# EasyEDA Pro project ProPrj_ETHlink8xADC_2025-03-31.epro, schematic ETHlink8xADC_Schematic, sheets 11 to 13 of 13

## Sheets
11 Preamp CH_7: Create Date: 2024-06-27; Page Name: Preamp CH_7; Schematic Name: Schematic1; Company: EMinc.; Part Number: 001; Reviewed: Eugenio Mancini; Version: V0.1
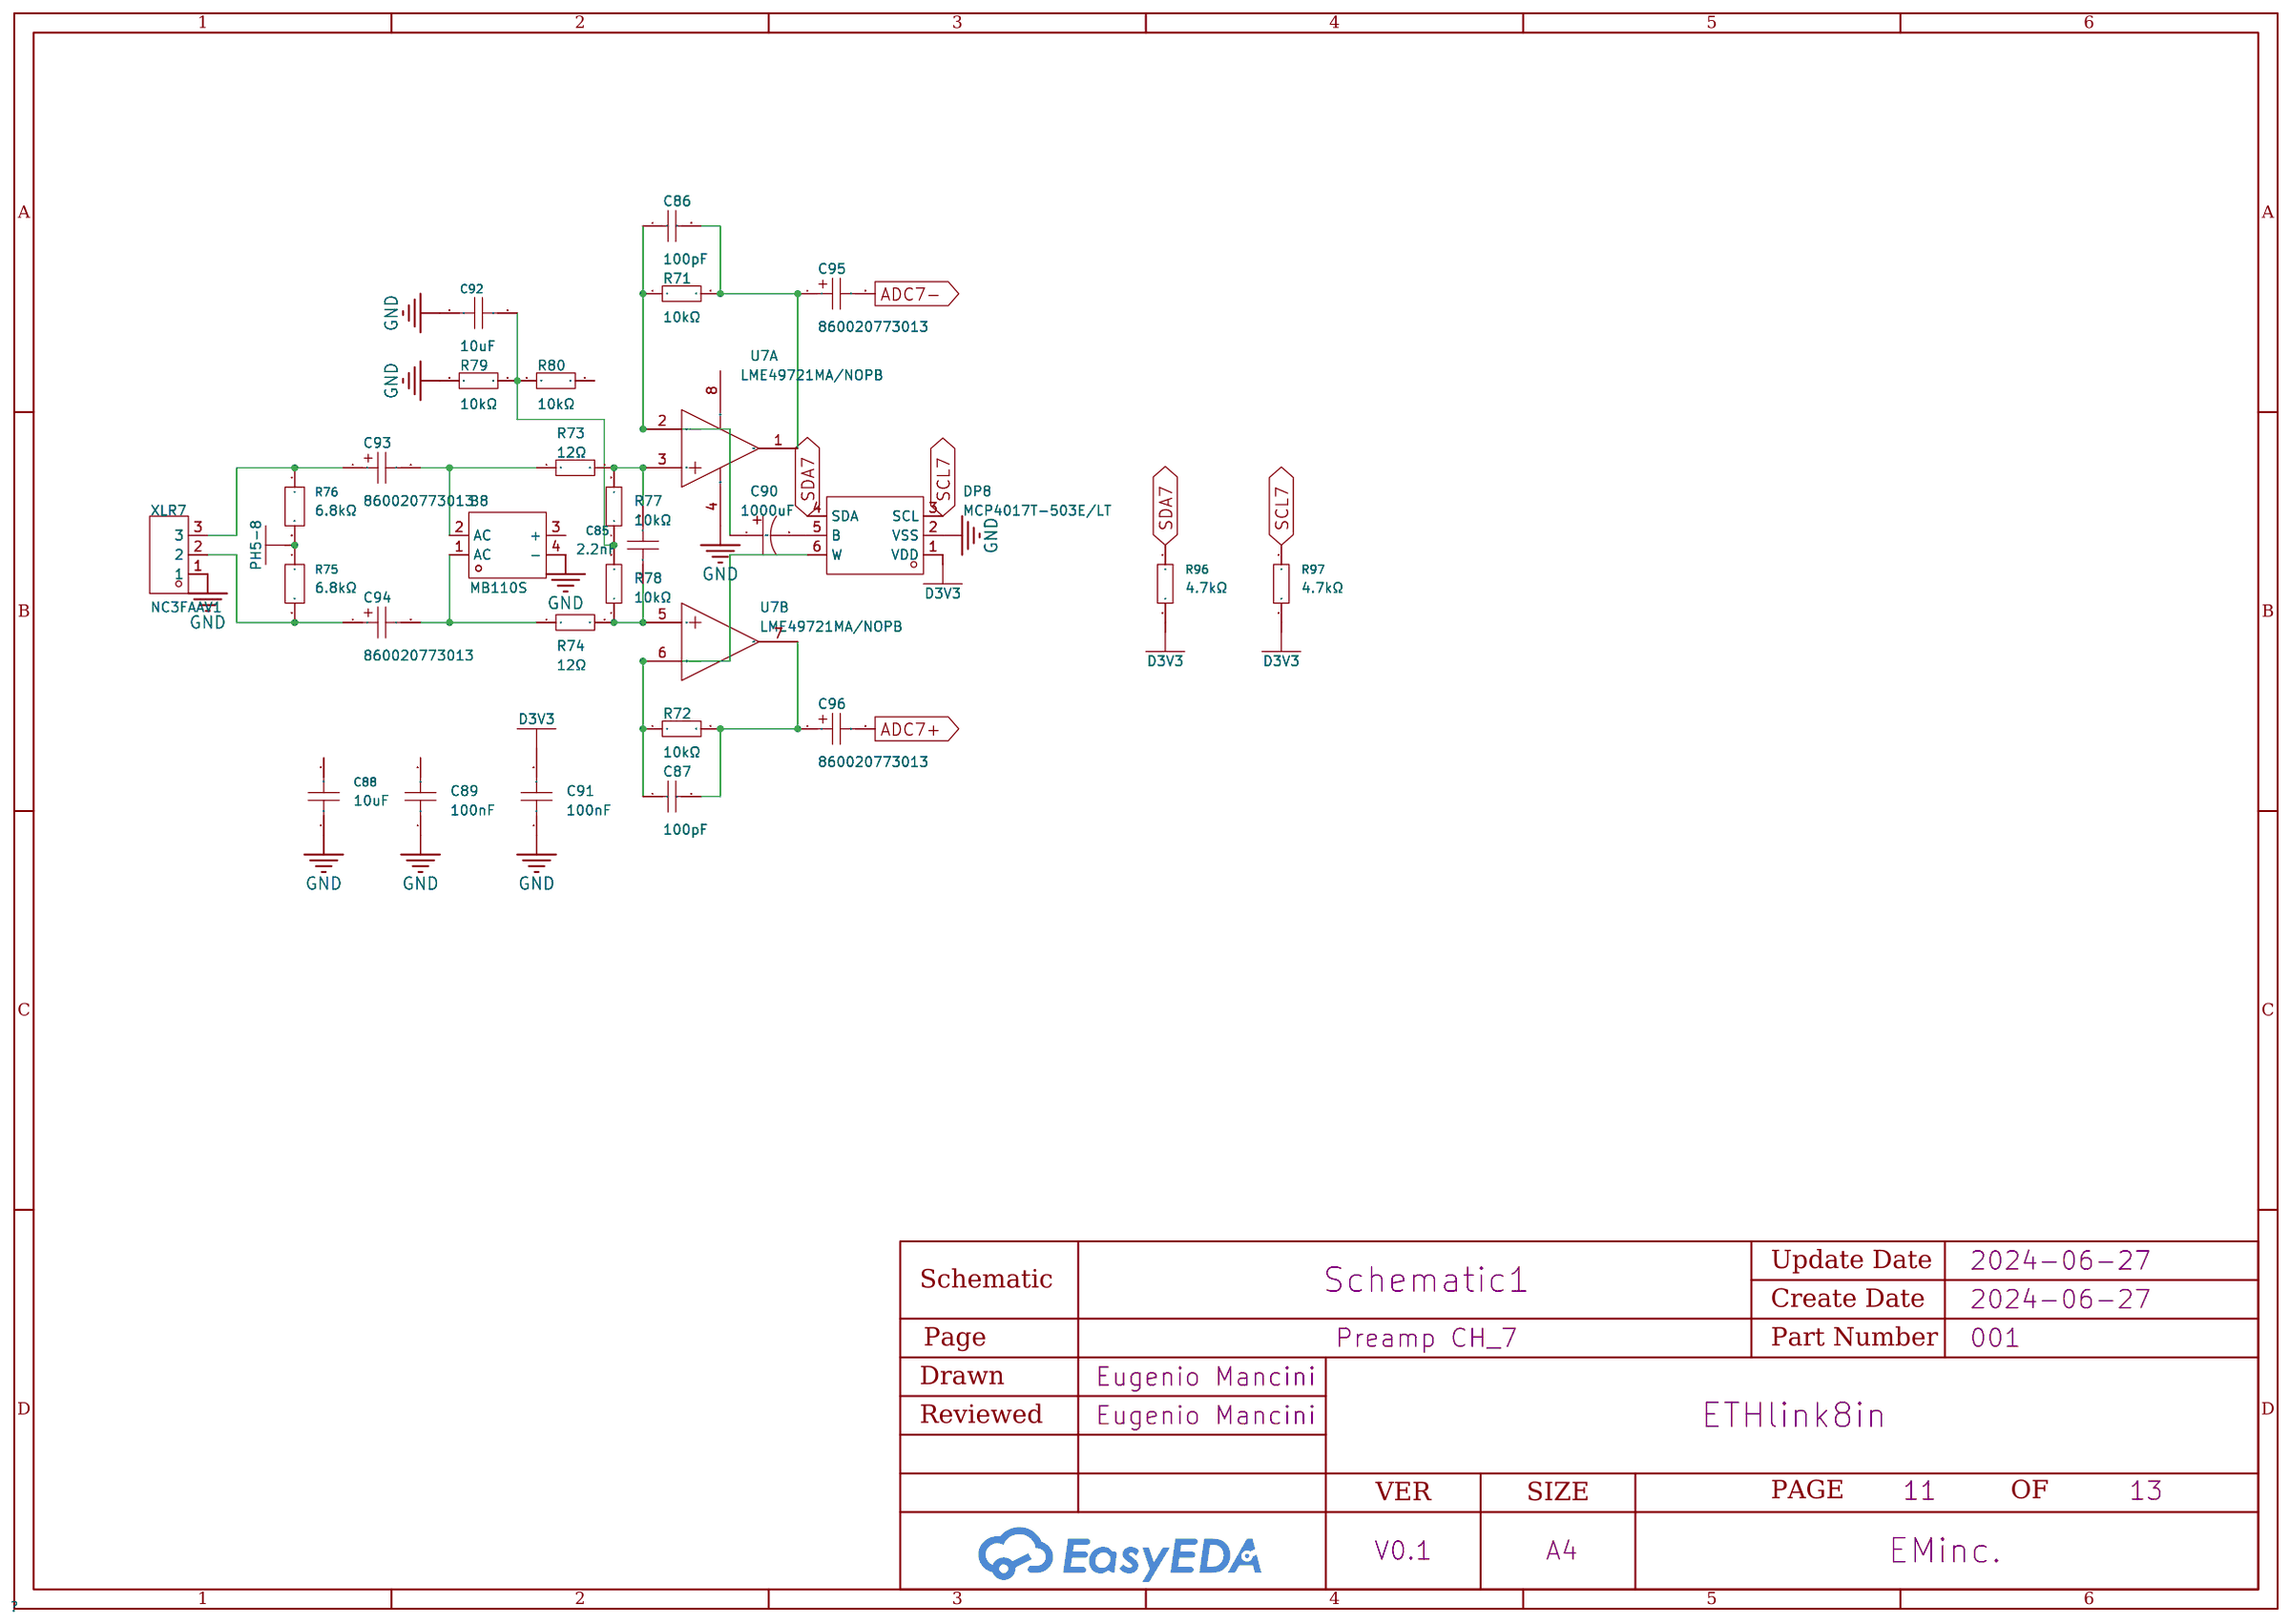
[diagram p10: Preamp CH_7]
12 Preamp CH_8: Create Date: 2024-06-27; Page Name: Preamp CH_8; Schematic Name: Schematic1; Company: EMinc.; Part Number: 001; Reviewed: Eugenio Mancini; Version: V0.1
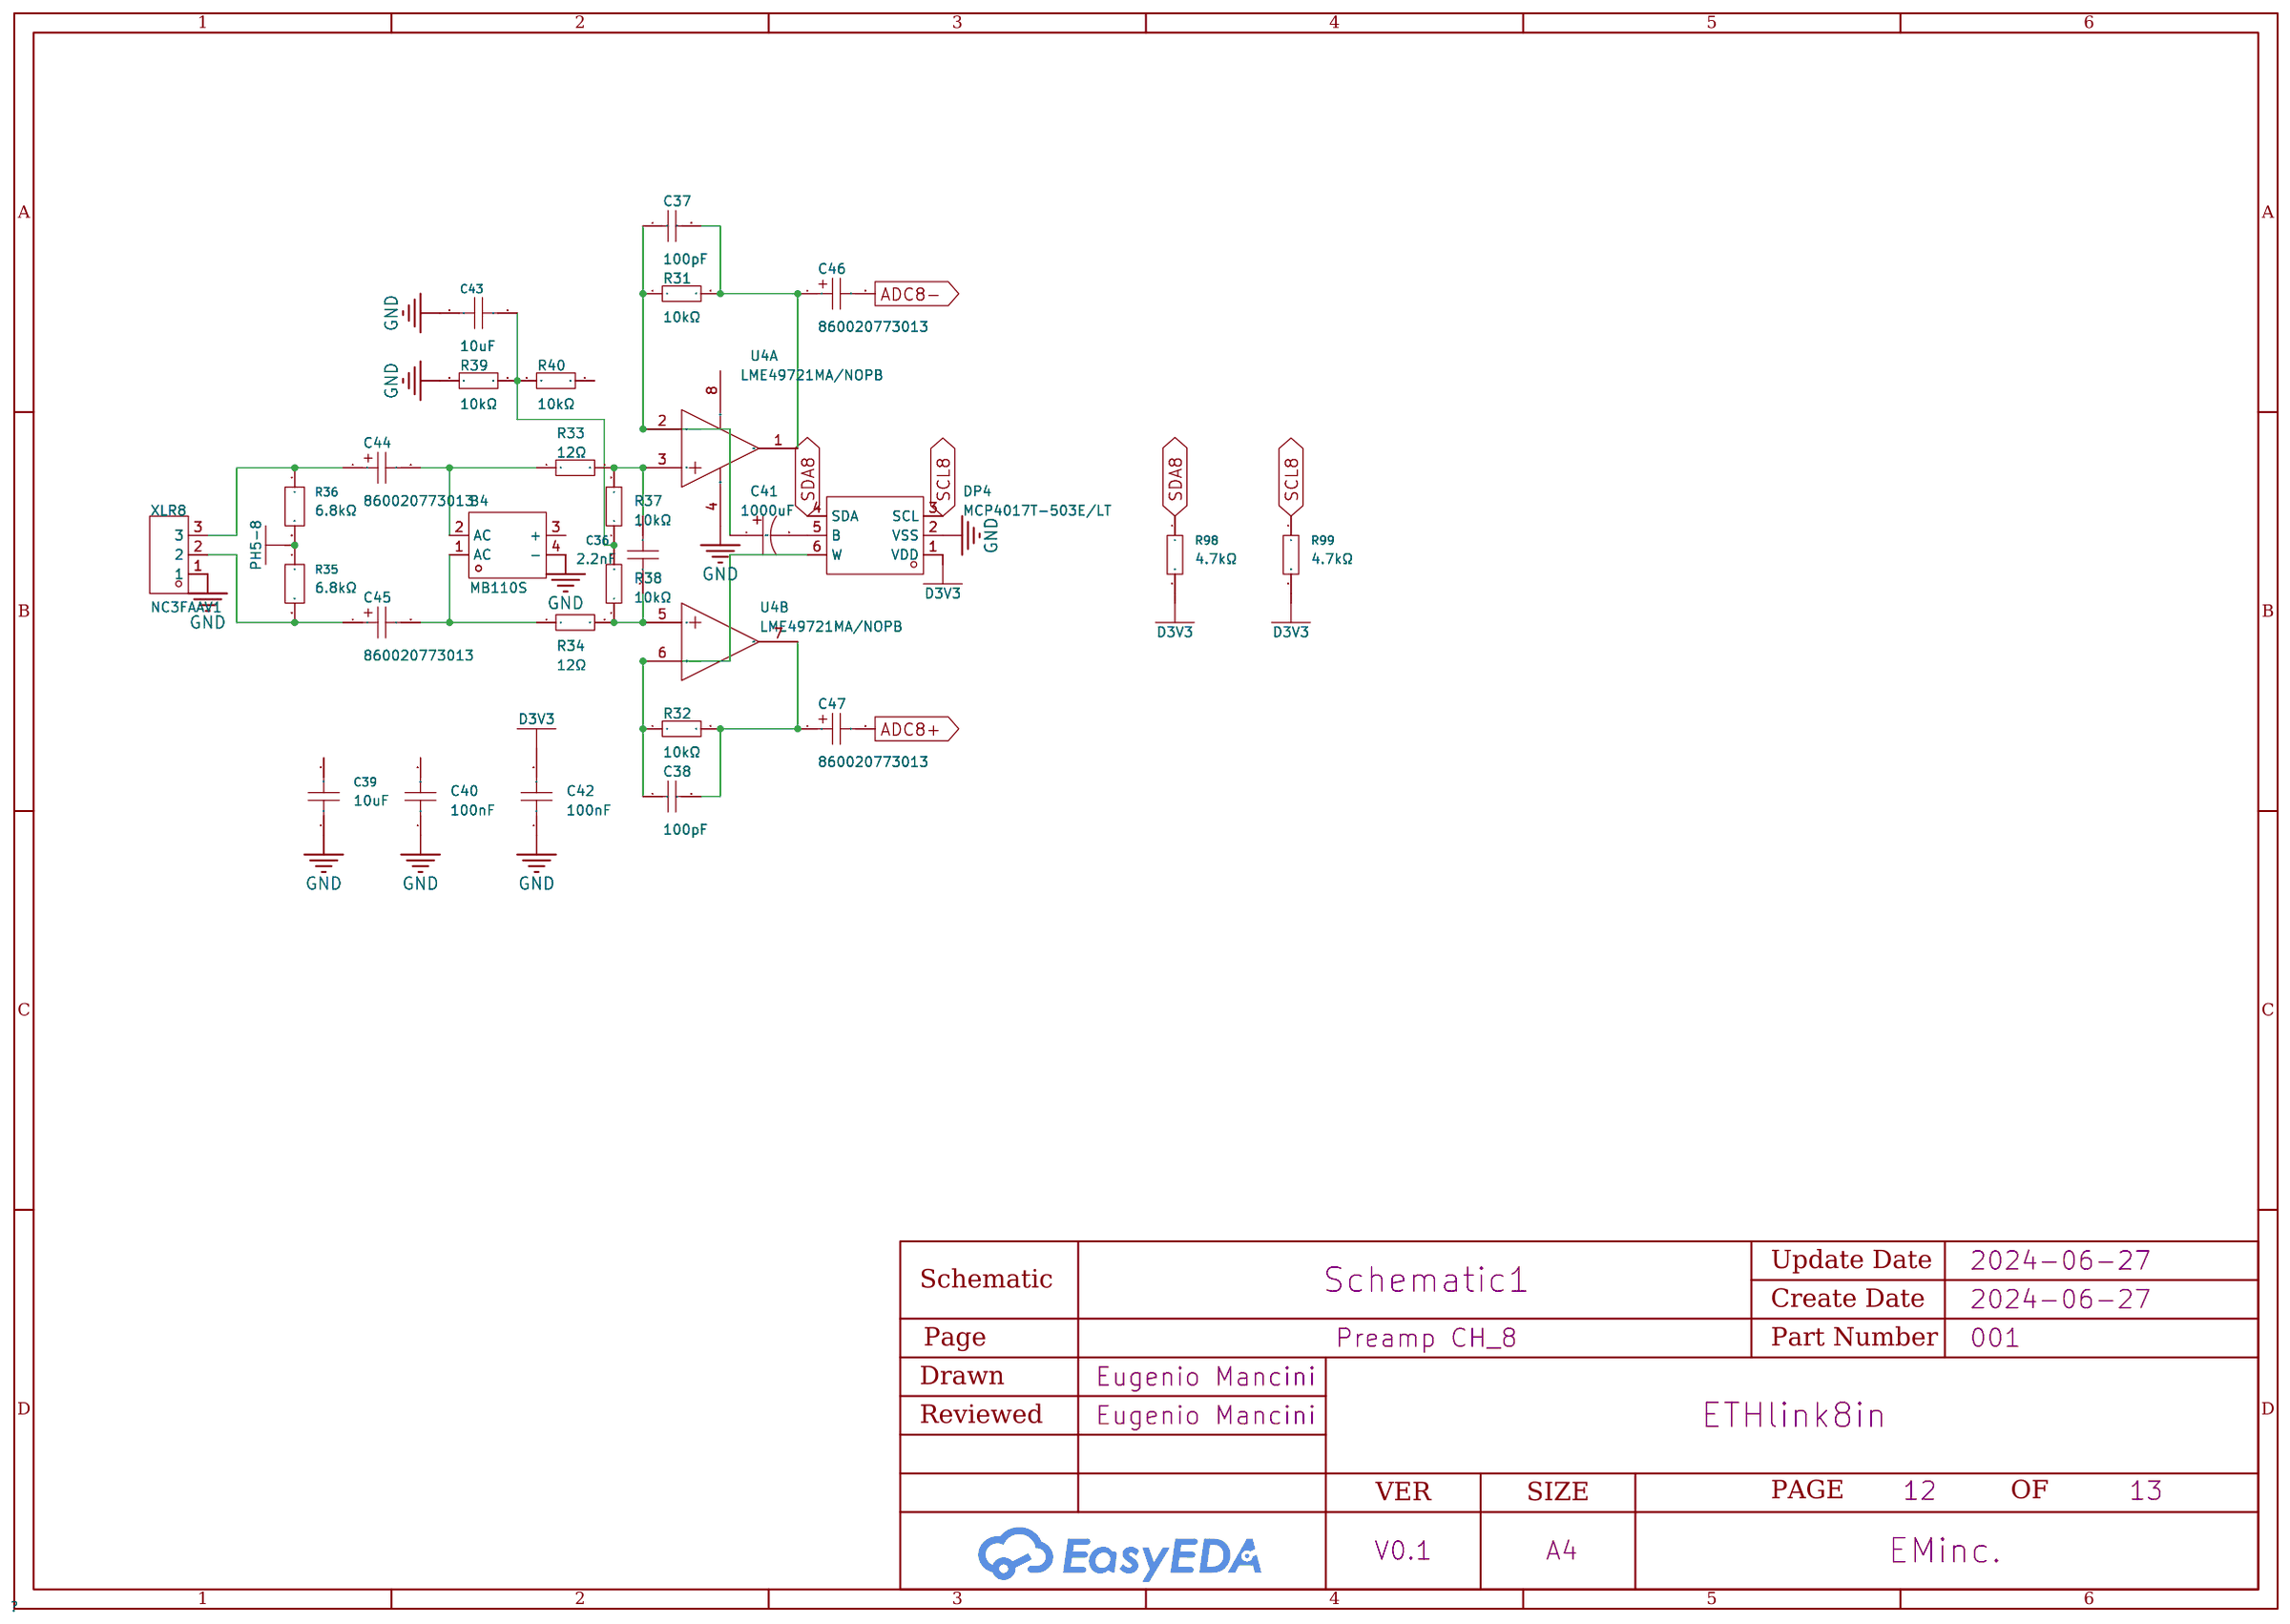
[diagram p11: Preamp CH_8]
13 ADC+RELAY+I2CMUX: Create Date: 2024-06-27; Page Name: ADC+RELAY+I2CMUX; Schematic Name: Schematic1; Company: EMinc.; Part Number: 001; Reviewed: Eugenio Mancini; Version: V0.1
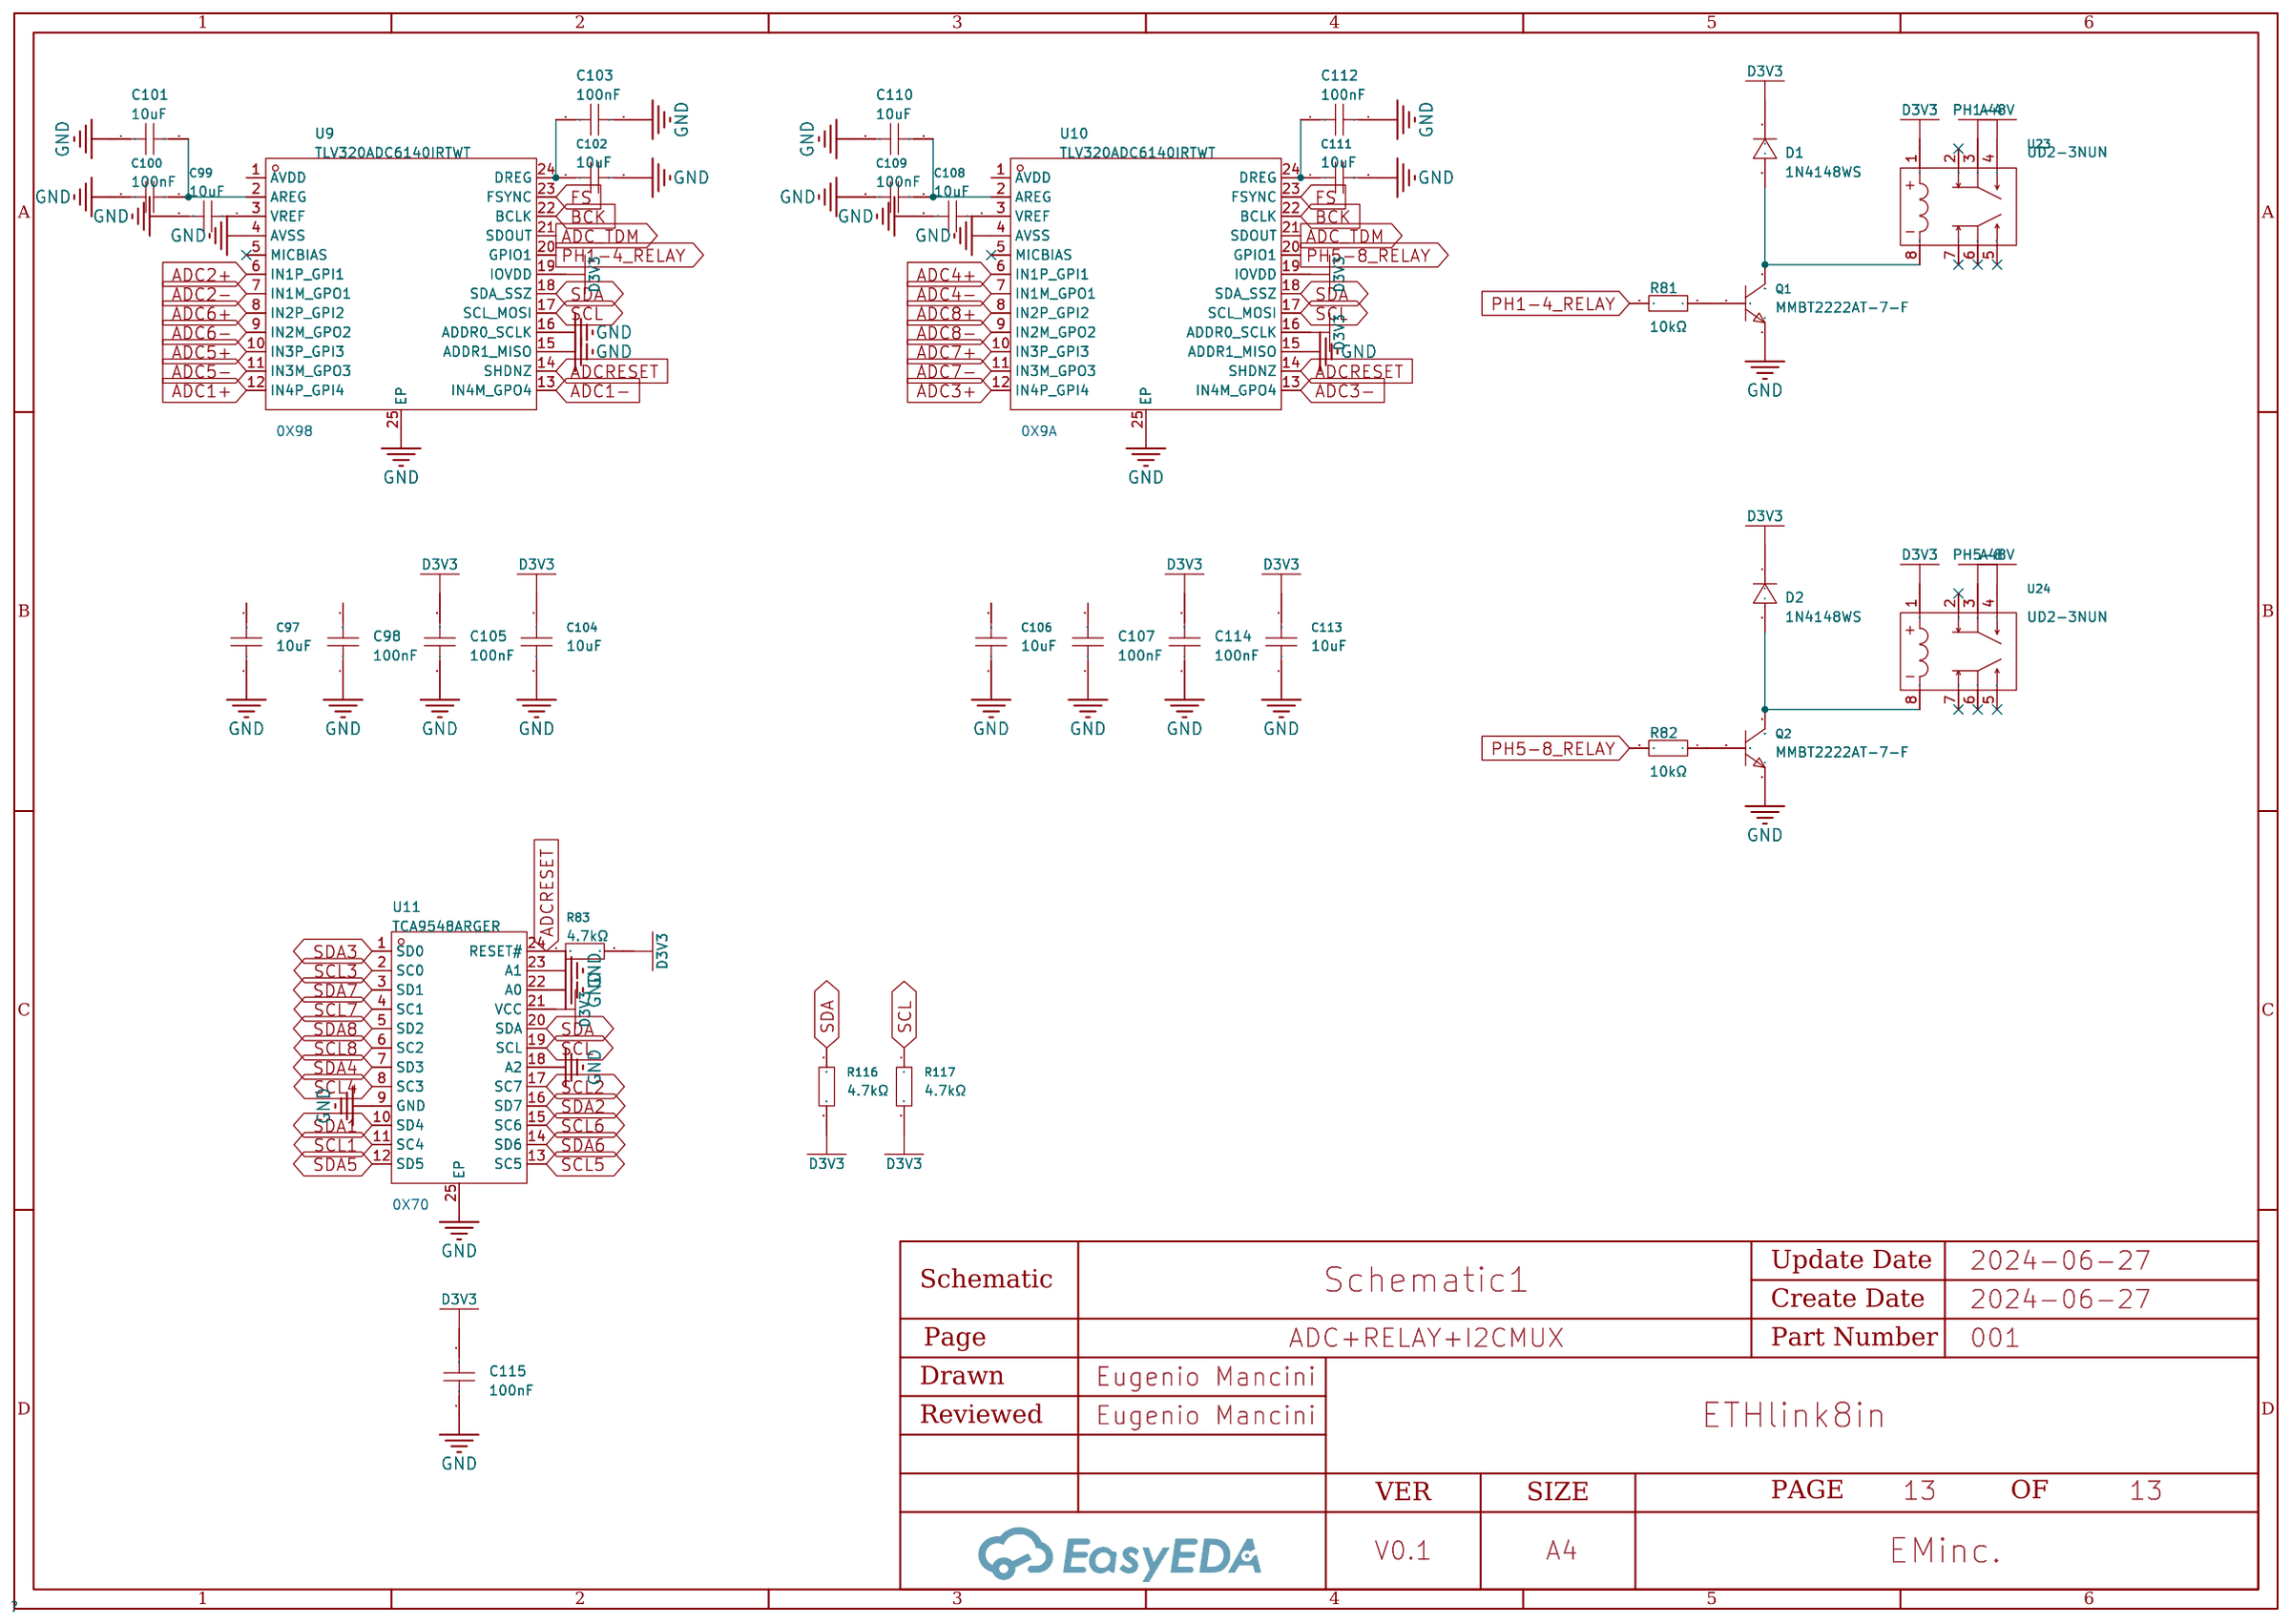
[diagram p12: ADC+RELAY+I2CMUX]

## Parts
sheet ADC+RELAY+I2CMUX
C97  10uF  [C0603]
C98  100nF  [C0603]
C99  10uF  [C0603]
C100  10uF  [C0603]
C101  100nF  [C0603]
C102  10uF  [C0603]
C103  100nF  [C0603]
C104  10uF  [C0603]
C105  100nF  [C0603]
C106  10uF  [C0603]
C107  100nF  [C0603]
C108  10uF  [C0603]
C109  10uF  [C0603]
C110  100nF  [C0603]
C111  10uF  [C0603]
C112  100nF  [C0603]
C113  10uF  [C0603]
C114  100nF  [C0603]
C115  100nF  [C0603]
D1  1N4148WS  [SOD-323_L1.7-W1.3-LS2.5-RD-1]
D2  1N4148WS  [SOD-323_L1.7-W1.3-LS2.5-RD-1]
Q1  MMBT2222AT-7-F  [SOT-523-3_L1.6-W0.8-P1.00-LS1.6-BR]
Q2  MMBT2222AT-7-F  [SOT-523-3_L1.6-W0.8-P1.00-LS1.6-BR]
R81  10kΩ  [R0603]
R82  10kΩ  [R0603]
R83  4.7kΩ  [R0603]
R116  4.7kΩ  [R0603]
R117  4.7kΩ  [R0603]
U9  TLV320ADC6140IRTWT  [WQFN-24_L4.0-W4.0-P0.50-BL-EP2.1]
U10  TLV320ADC6140IRTWT  [WQFN-24_L4.0-W4.0-P0.50-BL-EP2.1]
U11  TCA9548ARGER  [VQFN-24_L4.0-W4.0-P0.50-BL-EP2.5]
U23  UD2-3NUN  [RELAY-SMD_KEMET_UD2-XXNUN]
U24  UD2-3NUN  [RELAY-SMD_KEMET_UD2-XXNUN]
sheet Preamp CH_7
B8  MB110S  [MBS_L4.7-W4.0-P2.50-LS7.0-TL]
C85  2.2nF  [C0603]
C86  100pF  [C0603]
C87  100pF  [C0603]
C88  10uF  [C0603]
C89  100nF  [C0603]
C90  1000uF  [CAP-TH_BD8.0-P3.50-D0.6-FD-2]
C91  100nF  [C0603]
C92  10uF  [C0603]
C93  860020773013  [CAP-TH_BD6.3-P2.50-D0.5-FD]
C94  860020773013  [CAP-TH_BD6.3-P2.50-D0.5-FD]
C95  860020773013  [CAP-TH_BD6.3-P2.50-D0.5-FD]
C96  860020773013  [CAP-TH_BD6.3-P2.50-D0.5-FD]
DP8  MCP4017T-503E/LT  [SC-70-6_L2.0-W1.3-P0.65-LS2.1-BL]
R71  10kΩ  [R0603]
R72  10kΩ  [R0603]
R73  12Ω  [R0603]
R74  12Ω  [R0603]
R75  6.8kΩ  [R0805]
R76  6.8kΩ  [R0805]
R77  10kΩ  [R0603]
R78  10kΩ  [R0603]
R79  10kΩ  [R0603]
R80  10kΩ  [R0603]
R96  4.7kΩ  [R0603]
R97  4.7kΩ  [R0603]
U7  LME49721MA/NOPB  [SOIC-8_L4.9-W3.9-P1.27-LS6.0-BL]  (sections 1,2)
XLR7  NC3FAAV1  [CONN-TH_NC3FAAV1]
sheet Preamp CH_8
B4  MB110S  [MBS_L4.7-W4.0-P2.50-LS7.0-TL]
C36  2.2nF  [C0603]
C37  100pF  [C0603]
C38  100pF  [C0603]
C39  10uF  [C0603]
C40  100nF  [C0603]
C41  1000uF  [CAP-TH_BD8.0-P3.50-D0.6-FD-2]
C42  100nF  [C0603]
C43  10uF  [C0603]
C44  860020773013  [CAP-TH_BD6.3-P2.50-D0.5-FD]
C45  860020773013  [CAP-TH_BD6.3-P2.50-D0.5-FD]
C46  860020773013  [CAP-TH_BD6.3-P2.50-D0.5-FD]
C47  860020773013  [CAP-TH_BD6.3-P2.50-D0.5-FD]
DP4  MCP4017T-503E/LT  [SC-70-6_L2.0-W1.3-P0.65-LS2.1-BL]
R31  10kΩ  [R0603]
R32  10kΩ  [R0603]
R33  12Ω  [R0603]
R34  12Ω  [R0603]
R35  6.8kΩ  [R0805]
R36  6.8kΩ  [R0805]
R37  10kΩ  [R0603]
R38  10kΩ  [R0603]
R39  10kΩ  [R0603]
R40  10kΩ  [R0603]
R98  4.7kΩ  [R0603]
R99  4.7kΩ  [R0603]
U4  LME49721MA/NOPB  [SOIC-8_L4.9-W3.9-P1.27-LS6.0-BL]  (sections 1,2)
XLR8  NC3FAAV1  [CONN-TH_NC3FAAV1]

## Library data of the parts
C39 C43 C88 C92 C97 C99 C100 C102 C104 C106 C108 C109 C111 C113 = CL10A106MQ8NNNC: Capacitance: Tolerance:±20% Tolerance:±20% Voltage Rated: Temperature Coefficient:; LCSC Part Name: 10uF ±20% 6.3V; Supplier Part: C1691; Manufacturer: SAMSUNG(三星); Supplier Footprint: 0603; JLCPCB Part Class: Extended Part; Datasheet: https://atta.szlcsc.com/upload/public/pdf/source/20160218/1457707763339.pdf; Supplier: LCSC; Tolerance: ±20%
C40 C42 C89 C91 C98 C101 C103 C105 C107 C110 C112 C114 C115 = CL10B104KC8NNNC: Capacitance: Tolerance:±10% Tolerance:±10% Voltage Rated: Temperature Coefficient:; LCSC Part Name: 100nF ±10% 100V; Supplier Part: C15725; Manufacturer: SAMSUNG(三星); Supplier Footprint: 0603; JLCPCB Part Class: Extended Part; Datasheet: https://atta.szlcsc.com/upload/public/pdf/source/20160218/1457707763339.pdf; Supplier: LCSC; Tolerance: ±10%
D1 D2 = 1N4148WS_C212832: Diode Configuration: Forward Voltage (Vf@If):1.25V@150mA Reverse Voltage (Vr): Average Rectified Current (Io): Power Dissipation: Reverse Leakage Current:1uA@75V Reverse Recovery Time (trr): Operating Temperature:-55℃~+150℃@(Tj) Operating Temperature:-55℃; LCSC Part Name: 电压:75V 电流:300mA; Supplier Part: C212832; Manufacturer: DIOTEC(德欧泰克); Supplier Footprint: SOD-323; JLCPCB Part Class: Extended Part; Datasheet: https://atta.szlcsc.com/upload/public/pdf/source/20180629/C212832_63FAF9AABB71FCF1F50310BCFE3DBF9D.pdf; Supplier: LCSC; Forward Voltage (Vf@If): 1.25V@150mA; Reverse Leakage Current: 1uA@75V; Operating Temperature: -55℃~+150℃@(Tj)
Q1 Q2 = MMBT2222AT-7-F: Transistor Type: Collector Current (Ic): Collector-Emitter Breakdown Voltage (Vceo): Power Dissipation (Pd): DC Current Gain (hFE@Ic,Vce):100@150mA,10V DC Current Gain (hFE@Ic,Vce):100@150mA,10V Transition Frequency (fT):300MHz Collector Cut-Off Current (; LCSC Part Name: 耐压:40V 电流:600mA NPN; Supplier Part: C151009; Manufacturer: DIODES(美台); Supplier Footprint: SOT-523; JLCPCB Part Class: Extended Part; Datasheet: https://atta.szlcsc.com/upload/public/pdf/source/20171212/C151009_15130639183111177894.pdf; Supplier: LCSC; DC Current Gain (hFE@Ic,Vce): 100@150mA,10V; Transition Frequency (fT): 300MHz; Collector Cut-Off Current (Icbo): 10nA; Collector-Emitter Saturation Voltage (VCE(sat)@Ic,Ib): 1V@500mA,50mA; Operating Temperature: -55℃~+150℃@(Tj)
R31 R32 R37-R40 R71 R72 R77-R82 = RC0603FR-0710KL: Type:Thick Film Resistors Resistance: Tolerance:±1% Tolerance:±1% Power(Watts): Overload Voltage (Max): Temperature Coefficient:±100ppm/℃ Temperature Coefficient:±100ppm/℃ Operating Temperature Range:-55℃~+155℃ Operating Temperature Range:-55℃~+155℃; LCSC Part Name: 厚膜电阻 10kΩ ±1% 100mW; Supplier Part: C98220; Manufacturer: YAGEO(国巨); Supplier Footprint: 0603; JLCPCB Part Class: Extended Part; Datasheet: https://atta.szlcsc.com/upload/public/pdf/source/20180927/C295883_E8D83085EA81BD7DE0B2B681138C15EE.pdf; Supplier: LCSC; Type: Thick Film Resistors; Tolerance: ±1%; Temperature Coefficient: ±100ppm/℃; Operating Temperature Range: -55℃~+155℃
R83 R96-R99 R116 R117 = 0603WAF4701T5E: Type:Thick Film Resistors Resistance:4.7kΩ Tolerance:±1% Tolerance:±1% Power(Watts): Overload Voltage (Max): Temperature Coefficient:±100ppm/℃ Temperature Coefficient:±100ppm/℃ Operating Temperature Range:-55℃~+155℃ Operating Temperature Range:-55℃~+155℃; LCSC Part Name: 4.7kΩ ±1% 100mW 厚膜电阻; Supplier Part: C23162; Manufacturer: UNI-ROYAL(厚声); Supplier Footprint: 0603; JLCPCB Part Class: Basic Part; Datasheet: https://atta.szlcsc.com/upload/public/pdf/source/20200306/C422600_1E6D84923E4A46A82E41ADD87F860B5C.pdf; Supplier: LCSC; Type: Thick Film Resistors; Tolerance: ±1%; Temperature Coefficient: ±100ppm/℃; Operating Temperature Range: -55℃~+155℃
U9 U10 = TLV320ADC6140IRTWT: Supplier Part: C1852023; Manufacturer: TI(德州仪器); Supplier Footprint: WQFN-24-EP(4x4); JLCPCB Part Class: Extended Part; Datasheet: https://www.ti.com/cn/lit/gpn/tlv320adc6140; Supplier: LCSC
U11 = TCA9548ARGER: Type:Bus Switch Voltage Supply Source:Single supply Supply Voltage:1.65V~5.5V Supply Voltage:1.65V~5.5V Operating temperature:-40℃~+85℃ Operating temperature:-40℃~+85℃; Supplier Part: C555456; Manufacturer: TI(德州仪器); Supplier Footprint: VQFN-24-EP(4x4); JLCPCB Part Class: Extended Part; Datasheet: https://www.ti.com/cn/lit/gpn/tca9548a; Supplier: LCSC; Type: Bus Switch; Voltage Supply Source: Single supply; Supply Voltage: 1.65V~5.5V; Operating temperature: -40℃~+85℃
U23 U24 = UD2-3NUN: Coil Voltage:3V Contact Form:两组转换:2C(DPDT-转换) Contact Rating:- Maximum Switching Voltage:250V@AC；220V@DC Contact Material:银合金 Coil Resistance:- Maximum Switching Current:1A Operate Time:2ms Release Time:1ms Coil Type:- Contact Resistance:- Operating Tempe; LCSC Part Name: 3VDC 1A 无锁存; Supplier Part: C1560780; Manufacturer: KEMET(基美); Supplier Footprint: SMD,6.5x10.6mm; JLCPCB Part Class: Extended Part; Datasheet: https://atta.szlcsc.com/upload/public/pdf/source/20210422/81805E0F74F1F2A2C343E0508BF2DAF0.pdf; Supplier: LCSC; Coil Voltage: 3V; Contact Form: 两组转换:2C(DPDT-转换); Maximum Switching Voltage: 250V@AC；220V@DC; Contact Material: 银合金; Maximum Switching Current: 1A; Operate Time: 2ms; Release Time: 1ms; Operating Temperature: -40℃~+85℃
B4 B8 = MB110S: Forward Voltage (Vf@If):900mV@1A Reverse Voltage (Vr): Average Rectified Current (Io): Reverse Leakage Current (Ir):100uA@100V Peak Forward Surge Current: Operating Temperature:-55℃~+150℃@(Tj) Operating Temperature:-55℃~+150℃@(Tj); LCSC Part Name: 电压:100V 电流:1A; Supplier Part: C94545; Manufacturer: MDD(辰达半导体); Supplier Footprint: MBS; JLCPCB Part Class: Extended Part; Datasheet: https://atta.szlcsc.com/upload/public/pdf/source/20230823/CF8E6B9D12CAED444661F971FB52D378.pdf; Supplier: LCSC; Forward Voltage (Vf@If): 900mV@1A; Reverse Leakage Current (Ir): 100uA@100V; Operating Temperature: -55℃~+150℃@(Tj)
C36 C85 = GRM1885C1H222JA01D: Capacitance: Tolerance:±5% Tolerance:±5% Voltage Rated: Temperature Coefficient:; LCSC Part Name: 2.2nF ±5% 50V; Supplier Part: C77033; Manufacturer: muRata(村田); Supplier Footprint: 0603; JLCPCB Part Class: Extended Part; Datasheet: https://atta.szlcsc.com/upload/public/pdf/source/20200305/C490387_23319AE8C154DEB24C505E6C82A8106A.pdf; Supplier: LCSC; Tolerance: ±5%
C37 C38 C86 C87 = CL10C101JB8NNNC: Capacitance: Tolerance:±5% Tolerance:±5% Voltage Rated: Temperature Coefficient:; LCSC Part Name: 100pF ±5% 50V; Supplier Part: C14858; Manufacturer: SAMSUNG(三星); Supplier Footprint: 0603; JLCPCB Part Class: Basic Part; Datasheet: https://atta.szlcsc.com/upload/public/pdf/source/20160218/1457707763339.pdf; Supplier: LCSC; Tolerance: ±5%
C41 C90 = 6.3YXS1000MEFC8X11.5: Capacitance: Tolerance:±20% Tolerance:±20% Rated Voltage: Ripple Current:438mA@120Hz Equivalent Series Resistance(ESR):- Lead Spacing: φD: L: Lifetime @ Temp:4000hrs@105℃ Operating Temperature:-40℃~+105℃ Operating Temperature:-40℃~+105℃; LCSC Part Name: 1000uF ±20% 6.3V; Supplier Part: C5115430; Manufacturer: rubycon(红宝石); Supplier Footprint: 插件,D8xL11.5mm; JLCPCB Part Class: Extended Part; Datasheet: https://atta.szlcsc.com/upload/public/pdf/source/20221128/8AD20EA7405F8C40BF758105C4820F47.pdf; Supplier: LCSC; Tolerance: ±20%; Ripple Current: 438mA@120Hz; Lifetime @ Temp: 4000hrs@105℃; Operating Temperature: -40℃~+105℃
C44-C47 C93-C96 = 860020773013: Supplier Part: C7046938; Manufacturer: Wurth(伍尔特); Supplier Footprint: 插件; JLCPCB Part Class: Extended Part; Datasheet: https://atta.szlcsc.com/upload/public/pdf/source/20231023/860020773013.pdf-ae4cc118506be8cf0bae152b6102cbee.pdf; Supplier: LCSC
DP4 DP8 = MCP4017T-503E/LT: Resistance Value (Ohms):50kΩ Number of Taps:128 Interface Type:I2C Number of Channels:1 Supply Voltage:1.8V~5.5V Supply Voltage:1.8V~5.5V Precision:±20% Precision:±20% Temperature Coefficient (Typ):150ppm/℃ Temperature Coefficient (Typ):150ppm/℃ Operating; Supplier Part: C478095; Manufacturer: MICROCHIP(美国微芯); Supplier Footprint: SC-70-6; JLCPCB Part Class: Extended Part; Datasheet: https://atta.szlcsc.com/upload/public/pdf/source/20171212/C145561_15130636359521177681.pdf; Supplier: LCSC; Resistance Value (Ohms): 50kΩ; Number of Taps: 128; Interface Type: I2C; Number of Channels: 1; Supply Voltage: 1.8V~5.5V; Precision: ±20%; Temperature Coefficient (Typ): 150ppm/℃; Operating Temperature: -40℃~+125℃
R33 R34 R73 R74 = RC0603FR-0712RL: Type:Thick Film Resistors Resistance: Tolerance:±1% Tolerance:±1% Power(Watts): Overload Voltage (Max): Temperature Coefficient:±100ppm/℃ Temperature Coefficient:±100ppm/℃ Operating Temperature Range:-55℃~+155℃ Operating Temperature Range:-55℃~+155℃; LCSC Part Name: 厚膜电阻 12Ω ±1% 100mW; Supplier Part: C245909; Manufacturer: YAGEO(国巨); Supplier Footprint: 0603; JLCPCB Part Class: Extended Part; Datasheet: https://atta.szlcsc.com/upload/public/pdf/source/20181031/C326976_E9901E35333D136A19B6CE377E889A82.pdf; Supplier: LCSC; Type: Thick Film Resistors; Tolerance: ±1%; Temperature Coefficient: ±100ppm/℃; Operating Temperature Range: -55℃~+155℃
R35 R36 R75 R76 = AS05W2J0682T5E: Type:Thick Film Resistors Resistance:6.8kΩ Tolerance:±5% Tolerance:±5% Power(Watts): Overload Voltage (Max): Temperature Coefficient:±100ppm/℃ Temperature Coefficient:±100ppm/℃ Operating Temperature Range:-55℃~+155℃ Operating Temperature Range:-55℃~+155℃; LCSC Part Name: 6.8kΩ ±5% 500mW 厚膜电阻; Supplier Part: C560550; Manufacturer: UNI-ROYAL(厚声); Supplier Footprint: 0805; JLCPCB Part Class: Extended Part; Datasheet: https://atta.szlcsc.com/upload/public/pdf/source/20200723/C560412_34ABBCC623B52ADD707B94178459E29E.pdf; Supplier: LCSC; Type: Thick Film Resistors; Tolerance: ±5%; Temperature Coefficient: ±100ppm/℃; Operating Temperature Range: -55℃~+155℃
U4 U7 = LME49721MA/NOPB: Type of Power Amplifier: Speaker Channels:双声道 Output Power: Supply Voltage:- Supply Voltage:- Operating Temperature:-40℃~+85℃ Operating Temperature:-40℃~+85℃; Supplier Part: C1348133; Manufacturer: TI(德州仪器); Supplier Footprint: SOIC-8; JLCPCB Part Class: Extended Part; Datasheet: https://www.ti.com/cn/lit/gpn/lme49721; Supplier: LCSC; Speaker Channels: 双声道; Operating Temperature: -40℃~+85℃
XLR7 XLR8 = NC3FAAV1: Connector Type:XLR母插座 Current Rating (Max):- Operating Temperature Range:- Operating Temperature Range:-; Supplier Part: C368513; Manufacturer: NEUTRIK(优曲克); Supplier Footprint: 插件; JLCPCB Part Class: Extended Part; Datasheet: https://atta.szlcsc.com/upload/public/pdf/source/20190222/C368513_3D2EA58256C0ABD92AA33704412093B5.pdf; Supplier: LCSC; Connector Type: XLR母插座

## Nets
A3V3: B4.3(+) B8.3(+) C39.2 C40.2 C88.2 C89.2 C97.2 C98.2 C106.2 C107.2 R40.1 R80.1 U4.8(VDD) U7.8(VDD) U9.1(AVDD) U10.1(AVDD) ; also on sheet 1 5 6 7 8 9 10
A48V: U23.4 U24.4 ; also on sheet 1
D3V3: C42.2 C91.2 C104.1 C105.2 C113.1 C114.2 C115.2 D1.1(K) D2.1(K) DP4.1(VDD) DP8.1(VDD) R83.2 R96.2 R97.2 R98.2 R99.2 R116.2 R117.2 U9.19(IOVDD) U10.16(ADDR0_SCLK) U10.19(IOVDD) U11.21(VCC) U23.1 U24.1 ; also on sheet 1 2 3 4 5 6 7 8 9 10
GND: B4.4(-) B8.4(-) C39.1 C40.1 C42.1 C43.1 C88.1 C89.1 C91.1 C92.1 C97.1 C98.1 C99.2 C100.2 C101.1 C102.2 C103.1 C104.2 C105.1 C106.1 C107.1 C108.2 C109.2 C110.1 C111.2 C112.1 C113.2 C114.1 C115.1 DP4.2(VSS) DP8.2(VSS) Q1.2(E) Q2.2(E) R39.2 R79.2 U4.4(VSS) U7.4(VSS) U9.4(AVSS) U9.15(ADDR1_MISO) U9.16(ADDR0_SCLK) U9.25(EP) U10.4(AVSS) U10.15(ADDR1_MISO) U10.25(EP) U11.9(GND) U11.18(A2) U11.22(A0) U11.23(A1) U11.25(EP) XLR7.1 XLR8.1 ; also on sheet 1 2 3 4 5 6 7 8 9 10
ADC1+: U9.12(IN4P_GPI4) ; also on sheet 5
ADC1-: U9.13(IN4M_GPO4) ; also on sheet 5
ADC2+: U9.6(IN1P_GPI1) ; also on sheet 6
ADC2-: U9.7(IN1M_GPO1) ; also on sheet 6
ADC3+: U10.12(IN4P_GPI4) ; also on sheet 7
ADC3-: U10.13(IN4M_GPO4) ; also on sheet 7
ADC4+: U10.6(IN1P_GPI1) ; also on sheet 8
ADC4-: U10.7(IN1M_GPO1) ; also on sheet 8
ADC5+: U9.10(IN3P_GPI3) ; also on sheet 9
ADC5-: U9.11(IN3M_GPO3) ; also on sheet 9
ADC6+: U9.8(IN2P_GPI2) ; also on sheet 10
ADC6-: U9.9(IN2M_GPO2) ; also on sheet 10
ADC7+: C96.2 U10.10(IN3P_GPI3)
ADC7-: C95.2 U10.11(IN3M_GPO3)
ADC8+: C47.2 U10.8(IN2P_GPI2)
ADC8-: C46.2 U10.9(IN2M_GPO2)
ADC_TDM: U9.21(SDOUT) U10.21(SDOUT) ; also on sheet 2
ADCRESET: R83.1 U9.14(SHDNZ) U10.14(SHDNZ) U11.24(RESET#) ; also on sheet 2
BCK: U9.22(BCLK) U10.22(BCLK) ; also on sheet 2 4
FS: U9.23(FSYNC) U10.23(FSYNC) ; also on sheet 2 4
PH1-4: U23.3 ; also on sheet 5 6 7 8
PH1-4_RELAY: R81.2 U9.20(GPIO1)
PH5-8: R35.1 R36.2 R75.1 R76.2 U24.3 ; also on sheet 9 10
PH5-8_RELAY: R82.2 U10.20(GPIO1)
SCL: R117.1 U9.17(SCL_MOSI) U10.17(SCL_MOSI) U11.19(SCL) ; also on sheet 2 4
SCL1: U11.11(SC4) ; also on sheet 5
SCL2: U11.17(SC7) ; also on sheet 6
SCL3: U11.2(SC0) ; also on sheet 7
SCL4: U11.8(SC3) ; also on sheet 8
SCL5: U11.13(SC5) ; also on sheet 9
SCL6: U11.15(SC6) ; also on sheet 10
SCL7: DP8.3(SCL) R97.1 U11.4(SC1)
SCL8: DP4.3(SCL) R99.1 U11.6(SC2)
SDA: R116.1 U9.18(SDA_SSZ) U10.18(SDA_SSZ) U11.20(SDA) ; also on sheet 2 4
SDA1: U11.10(SD4) ; also on sheet 5
SDA2: U11.16(SD7) ; also on sheet 6
SDA3: U11.1(SD0) ; also on sheet 7
SDA4: U11.7(SD3) ; also on sheet 8
SDA5: U11.12(SD5) ; also on sheet 9
SDA6: U11.14(SD6) ; also on sheet 10
SDA7: DP8.4(SDA) R96.1 U11.3(SD1)
SDA8: DP4.4(SDA) R98.1 U11.5(SD2)
$12N1968: C87.2 C96.1 R72.2 U7.7(OUT B)
$12N1989: C86.2 C95.1 R71.2 U7.1(OUT A)
$12N2290: C87.1 DP8.6(W) R72.1 U7.6(IN B-)
$12N2380: C90.2 DP8.5(B)
$12N2424: C86.1 C90.1 R71.1 U7.2(IN A-)
$12N2717: C92.2 R77.1 R78.2 R79.1 R80.2
$12N2736: B8.2(AC) C93.2 R73.1
$12N2751: B8.1(AC) C94.2 R74.1
$12N20416: C93.1 R76.1 XLR7.3
$12N20422: C94.1 R75.2 XLR7.2
$12N21169: C85.2 R73.2 R77.2 U7.3(IN A+)
$12N21173: C85.1 R74.2 R78.1 U7.5(IN B+)
$13N1968: C38.2 C47.1 R32.2 U4.7(OUT B)
$13N1989: C37.2 C46.1 R31.2 U4.1(OUT A)
$13N2290: C38.1 DP4.6(W) R32.1 U4.6(IN B-)
$13N2380: C41.2 DP4.5(B)
$13N2424: C37.1 C41.1 R31.1 U4.2(IN A-)
$13N2717: C43.2 R37.1 R38.2 R39.1 R40.2
$13N2736: B4.2(AC) C44.2 R33.1
$13N2751: B4.1(AC) C45.2 R34.1
$13N22501: C44.1 R36.1 XLR8.3
$13N22507: C45.1 R35.2 XLR8.2
$13N23254: C36.2 R33.2 R37.2 U4.3(IN A+)
$13N23258: C36.1 R34.2 R38.1 U4.5(IN B+)
$14N25127: C99.1 U9.3(VREF)
$14N25237: C100.1 C101.2 U9.2(AREG)
$14N25325: C102.1 C103.2 U9.24(DREG)
$14N27447: C108.1 U10.3(VREF)
$14N27451: C109.1 C110.2 U10.2(AREG)
$14N27452: C111.1 C112.2 U10.24(DREG)
$14N27857: D1.2(A) Q1.3(C) U23.8
$14N27861: D2.2(A) Q2.3(C) U24.8
$14N28012: Q1.1(B) R81.1
$14N28104: Q2.1(B) R82.1

Not connected (* = marked no-connect by the designer): U9 5(MICBIAS)*; U10 5(MICBIAS)*; U23 2* 5* 6* 7*; U24 2* 5* 6* 7*

## Notes on the sheets
sheet 13
- 0X98
- 0X9A
- 0X70
